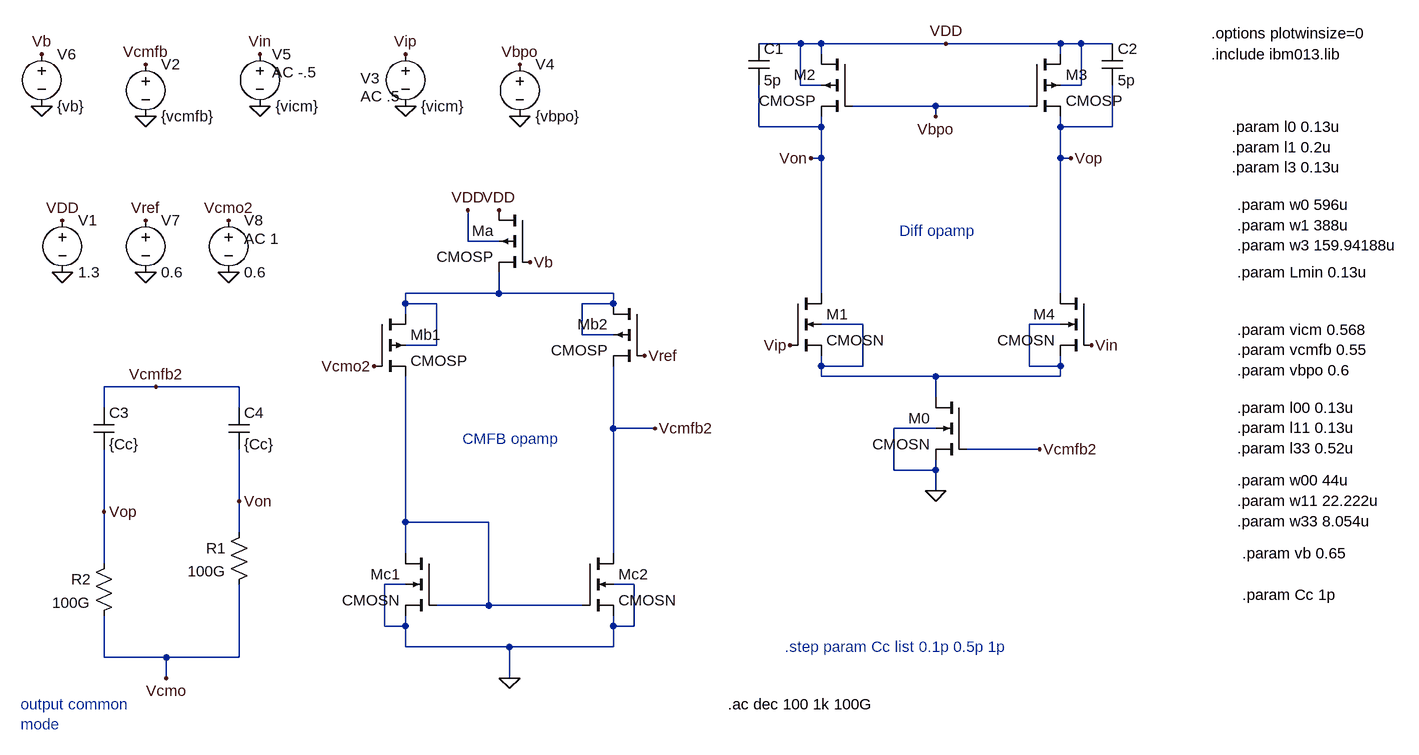
[diagram p0: schematic homework4.asc]
homework4.asc, the LTspice schematic file:
Version 4
SHEET 1 1068 680
WIRE -432 -880 -496 -880
WIRE -400 -880 -432 -880
WIRE -208 -880 -400 -880
WIRE -32 -880 -208 -880
WIRE 0 -880 -32 -880
WIRE 48 -880 0 -880
WIRE -400 -864 -400 -880
WIRE -32 -864 -32 -880
WIRE -432 -816 -432 -880
WIRE -400 -816 -432 -816
WIRE 0 -816 0 -880
WIRE 0 -816 -32 -816
WIRE -224 -784 -352 -784
WIRE -80 -784 -224 -784
WIRE -224 -768 -224 -784
WIRE -496 -752 -496 -816
WIRE -400 -752 -400 -768
WIRE -400 -752 -496 -752
WIRE -32 -752 -32 -768
WIRE 48 -752 48 -816
WIRE 48 -752 -32 -752
WIRE -400 -704 -400 -752
WIRE -400 -704 -416 -704
WIRE -32 -704 -32 -752
WIRE -16 -704 -32 -704
WIRE -944 -576 -944 -624
WIRE -896 -576 -944 -576
WIRE -896 -496 -896 -528
WIRE -896 -496 -1040 -496
WIRE -720 -496 -896 -496
WIRE -400 -496 -400 -704
WIRE -32 -496 -32 -704
WIRE -1040 -480 -1040 -496
WIRE -992 -480 -1040 -480
WIRE -720 -480 -720 -496
WIRE -720 -480 -768 -480
WIRE -1040 -464 -1040 -480
WIRE -336 -448 -400 -448
WIRE -32 -448 -80 -448
WIRE -768 -432 -768 -480
WIRE -720 -432 -768 -432
WIRE -992 -416 -992 -480
WIRE -992 -416 -1040 -416
WIRE -400 -384 -400 -400
WIRE -336 -384 -336 -448
WIRE -336 -384 -400 -384
WIRE -80 -384 -80 -448
WIRE -32 -384 -32 -400
WIRE -32 -384 -80 -384
WIRE -400 -368 -400 -384
WIRE -224 -368 -400 -368
WIRE -32 -368 -32 -384
WIRE -32 -368 -224 -368
WIRE -1424 -352 -1504 -352
WIRE -1296 -352 -1424 -352
WIRE -224 -336 -224 -368
WIRE -1504 -320 -1504 -352
WIRE -1296 -320 -1296 -352
WIRE -720 -288 -720 -384
WIRE -656 -288 -720 -288
WIRE -224 -288 -288 -288
WIRE -64 -256 -176 -256
WIRE -288 -224 -288 -288
WIRE -224 -224 -224 -240
WIRE -224 -224 -288 -224
WIRE -224 -192 -224 -224
WIRE -1296 -176 -1296 -256
WIRE -1504 -160 -1504 -256
WIRE -1040 -144 -1040 -368
WIRE -912 -144 -1040 -144
WIRE -1296 -128 -1296 -176
WIRE -1040 -96 -1040 -144
WIRE -720 -96 -720 -288
WIRE -1504 -80 -1504 -160
WIRE -1040 -48 -1072 -48
WIRE -688 -48 -720 -48
WIRE -912 -16 -912 -144
WIRE -912 -16 -992 -16
WIRE -768 -16 -912 -16
WIRE -1072 16 -1072 -48
WIRE -1040 16 -1040 0
WIRE -1040 16 -1072 16
WIRE -720 16 -720 0
WIRE -688 16 -688 -48
WIRE -688 16 -720 16
WIRE -1040 48 -1040 16
WIRE -880 48 -1040 48
WIRE -720 48 -720 16
WIRE -720 48 -880 48
WIRE -1504 64 -1504 0
WIRE -1408 64 -1504 64
WIRE -1296 64 -1296 -48
WIRE -1296 64 -1408 64
WIRE -1408 96 -1408 64
WIRE -880 96 -880 48
FLAG -224 -192 0
FLAG -1568 -528 0
FLAG -224 -768 Vbpo
FLAG -416 -704 Von
FLAG -16 -704 Vop
FLAG -64 -256 Vcmfb2
FLAG -1440 -768 0
FLAG -1440 -848 Vcmfb
FLAG -1040 -784 0
FLAG -864 -768 0
FLAG -864 -848 Vbpo
FLAG -1296 -176 Von
FLAG -1504 -160 Vop
FLAG -1264 -784 0
FLAG -1568 -608 VDD
FLAG -208 -880 VDD
FLAG -1040 -864 Vip
FLAG -448 -416 Vip
FLAG -1264 -864 Vin
FLAG 16 -416 Vin
FLAG -944 -624 VDD
FLAG -896 -624 VDD
FLAG -1600 -784 0
FLAG -1600 -864 Vb
FLAG -880 96 0
FLAG -1440 -528 0
FLAG -1440 -608 Vref
FLAG -656 -288 Vcmfb2
FLAG -672 -400 Vref
FLAG -1408 96 Vcmo
FLAG -1088 -384 Vcmo2
FLAG -1312 -528 0
FLAG -1312 -608 Vcmo2
FLAG -848 -544 Vb
FLAG -1424 -352 Vcmfb2
DATAFLAG -400 -608 ""
DATAFLAG -1408 64 ""
DATAFLAG -32 -608 ""
DATAFLAG -1040 -240 ""
DATAFLAG -208 -368 ""
DATAFLAG -720 -240 ""
DATAFLAG -848 -496 ""
SYMBOL cmosn -448 -496 R0
SYMATTR InstName M1
SYMATTR Value2 l={l1} w={w1} ad={2*w1*Lmin} as={2*w1*Lmin} pd={2*w1+4*Lmin} ps={2*w1+4*Lmin}
SYMBOL cmosp -352 -864 M0
SYMATTR InstName M2
SYMATTR Value2 l={l3} w={w3} ad={2*w3*Lmin} as={2*w3*Lmin} pd={2*w3+4*Lmin} ps={2*w3+4*Lmin}
SYMBOL voltage -1568 -624 R0
SYMATTR InstName V1
SYMATTR Value 1.3
SYMBOL cmosp -80 -864 R0
SYMATTR InstName M3
SYMATTR Value2 l={l3} w={w3} ad={2*w3*Lmin} as={2*w3*Lmin} pd={2*w3+4*Lmin} ps={2*w3+4*Lmin}
SYMBOL cmosn 16 -496 M0
SYMATTR InstName M4
SYMATTR Value2 l={l1} w={w1} ad={2*w1*Lmin} as={2*w1*Lmin} pd={2*w1+4*Lmin} ps={2*w1+4*Lmin}
SYMBOL cmosn -176 -336 M0
SYMATTR InstName M0
SYMATTR Value2 l={l0} w={w0} ad={2*w0*Lmin} as={2*w0*Lmin} pd={2*w0+4*Lmin} ps={2*w0+4*Lmin}
SYMBOL voltage -1440 -864 R0
WINDOW 123 24 124 Left 2
WINDOW 39 0 0 Left 0
SYMATTR InstName V2
SYMATTR Value {vcmfb}
SYMBOL cap -512 -880 R0
SYMATTR InstName C1
SYMATTR Value 5p
SYMBOL cap 32 -880 R0
SYMATTR InstName C2
SYMATTR Value 5p
SYMBOL voltage -1040 -880 R0
WINDOW 123 -69 81 Left 2
WINDOW 39 0 0 Left 0
WINDOW 0 -69 53 Left 2
SYMATTR Value2 AC .5
SYMATTR InstName V3
SYMATTR Value {vicm}
SYMBOL voltage -864 -864 R0
WINDOW 123 0 0 Left 0
WINDOW 39 0 0 Left 0
SYMATTR InstName V4
SYMATTR Value {vbpo}
SYMBOL res -1280 -144 M0
SYMATTR InstName R1
SYMATTR Value 100G
SYMBOL res -1488 -96 M0
SYMATTR InstName R2
SYMATTR Value 100G
SYMBOL voltage -1264 -880 R0
WINDOW 123 19 44 Left 2
WINDOW 39 0 0 Left 0
WINDOW 0 19 16 Left 2
SYMATTR Value2 AC -.5
SYMATTR InstName V5
SYMATTR Value {vicm}
SYMBOL cmosp -1088 -464 R0
SYMATTR InstName Mb1
SYMATTR Value2 l={l11} w={w11} ad={2*Lmin*w11} as={2*Lmin*w11} pd={2*w11+4*Lmin} ps={2*w11+4*Lmin}
SYMBOL cmosp -848 -624 M0
SYMATTR InstName Ma
SYMATTR Value2 l={l00} w={w00} ad={2*Lmin*w00} as={2*Lmin*w00} pd={2*w00+4*Lmin} ps={2*w00+4*Lmin}
SYMBOL cmosn -992 -96 M0
SYMATTR InstName Mc1
SYMATTR Value2 l={l33} w={w33} ad={2*Lmin*w33} as={2*Lmin*w33} pd={2*w33+4*Lmin} ps={2*w33+4*Lmin}
SYMBOL voltage -1600 -880 R0
WINDOW 123 0 0 Left 0
WINDOW 39 0 0 Left 0
SYMATTR InstName V6
SYMATTR Value {vb}
SYMBOL voltage -1440 -624 R0
WINDOW 123 0 0 Left 0
WINDOW 39 0 0 Left 0
SYMATTR InstName V7
SYMATTR Value 0.6
SYMBOL voltage -1312 -624 R0
WINDOW 123 24 44 Left 2
WINDOW 39 0 0 Left 0
SYMATTR Value2 AC 1
SYMATTR InstName V8
SYMATTR Value 0.6
SYMBOL cmosn -768 -96 R0
SYMATTR InstName Mc2
SYMATTR Value2 l={l33} w={w33} ad={2*Lmin*w33} as={2*Lmin*w33} pd={2*w33+4*Lmin} ps={2*w33+4*Lmin}
SYMBOL cmosp -672 -480 M0
SYMATTR InstName Mb2
SYMATTR Value2 l={l11} w={w11} ad={2*Lmin*w11} as={2*Lmin*w11} pd={2*w11+4*Lmin} ps={2*w11+4*Lmin}
SYMBOL cap -1520 -320 R0
SYMATTR InstName C3
SYMATTR Value {Cc}
SYMBOL cap -1312 -320 R0
SYMATTR InstName C4
SYMATTR Value {Cc}
TEXT 200 -864 Left 2 !.include ibm013.lib
TEXT 240 -528 Left 2 !.param Lmin 0.13u
TEXT 232 -752 Left 2 !.param l0 0.13u\n.param l1 0.2u\n.param l3 0.13u
TEXT 200 -896 Left 2 !.options plotwinsize=0
TEXT 240 -632 Left 2 !.param w0 596u\n.param w1 388u\n.param w3 159.94188u
TEXT 240 -440 Left 2 !.param vicm 0.568\n.param vcmfb 0.55\n.param vbpo 0.6
TEXT -544 136 Left 2 !.ac dec 100 1k 100G
TEXT 240 -320 Left 2 !.param l00 0.13u\n.param l11 0.13u\n.param l33 0.52u
TEXT 240 -208 Left 2 !.param w00 44u\n.param w11 22.222u\n.param w33 8.054u
TEXT 248 -96 Left 2 !.param vb 0.65
TEXT 248 -32 Left 2 !.param Cc 1p
TEXT -1632 136 Left 2 ;output common\nmode
TEXT -952 -272 Left 2 ;CMFB opamp
TEXT -280 -592 Left 2 ;Diff opamp
TEXT -456 48 Left 2 ;.step param Cc list 0.1p 0.5p 1p

The netlist it stands for:
* homework4.asc
M1 Von Vip N002 N002 CMOSN l={l1} w={w1} ad={2*w1*Lmin} as={2*w1*Lmin} pd={2*w1+4*Lmin} ps={2*w1+4*Lmin}
M2 VDD Vbpo Von VDD CMOSP l={l3} w={w3} ad={2*w3*Lmin} as={2*w3*Lmin} pd={2*w3+4*Lmin} ps={2*w3+4*Lmin}
V1 VDD 0 1.3
M3 VDD Vbpo Vop VDD CMOSP l={l3} w={w3} ad={2*w3*Lmin} as={2*w3*Lmin} pd={2*w3+4*Lmin} ps={2*w3+4*Lmin}
M4 Vop Vin N002 N002 CMOSN l={l1} w={w1} ad={2*w1*Lmin} as={2*w1*Lmin} pd={2*w1+4*Lmin} ps={2*w1+4*Lmin}
M0 N002 Vcmfb2 0 0 CMOSN l={l0} w={w0} ad={2*w0*Lmin} as={2*w0*Lmin} pd={2*w0+4*Lmin} ps={2*w0+4*Lmin}
V2 Vcmfb 0 {vcmfb}
C1 VDD Von 5p
C2 VDD Vop 5p
V3 Vip 0 {vicm} AC .5
V4 Vbpo 0 {vbpo}
R1 Von Vcmo 100G
R2 Vop Vcmo 100G
V5 Vin 0 {vicm} AC -.5
Mb1 N001 Vcmo2 N003 N001 CMOSP l={l11} w={w11} ad={2*Lmin*w11} as={2*Lmin*w11} pd={2*w11+4*Lmin} ps={2*w11+4*Lmin}
Ma VDD Vb N001 VDD CMOSP l={l00} w={w00} ad={2*Lmin*w00} as={2*Lmin*w00} pd={2*w00+4*Lmin} ps={2*w00+4*Lmin}
Mc1 N003 N003 0 0 CMOSN l={l33} w={w33} ad={2*Lmin*w33} as={2*Lmin*w33} pd={2*w33+4*Lmin} ps={2*w33+4*Lmin}
V6 Vb 0 {vb}
V7 Vref 0 0.6
V8 Vcmo2 0 0.6 AC 1
Mc2 Vcmfb2 N003 0 0 CMOSN l={l33} w={w33} ad={2*Lmin*w33} as={2*Lmin*w33} pd={2*w33+4*Lmin} ps={2*w33+4*Lmin}
Mb2 N001 Vref Vcmfb2 N001 CMOSP l={l11} w={w11} ad={2*Lmin*w11} as={2*Lmin*w11} pd={2*w11+4*Lmin} ps={2*w11+4*Lmin}
C3 Vcmfb2 Vop {Cc}
C4 Vcmfb2 Von {Cc}
.model NMOS NMOS
.model PMOS PMOS
.lib standard.mos
.include ibm013.lib
.param Lmin 0.13u
.param l0 0.13u
.param l1 0.2u
.param l3 0.13u
.options plotwinsize=0
.param w0 596u
.param w1 388u
.param w3 159.94188u
.param vicm 0.568
.param vcmfb 0.55
.param vbpo 0.6
.ac dec 100 1k 100G
.param l00 0.13u
.param l11 0.13u
.param l33 0.52u
.param w00 44u
.param w11 22.222u
.param w33 8.054u
.param vb 0.65
.param Cc 1p
* output common
* mode
* CMFB opamp
* Diff opamp
* .step param Cc list 0.1p 0.5p 1p
.backanno
.end